# EAGLE design XBee_RPi_breakout (EAGLE 8.6.0)
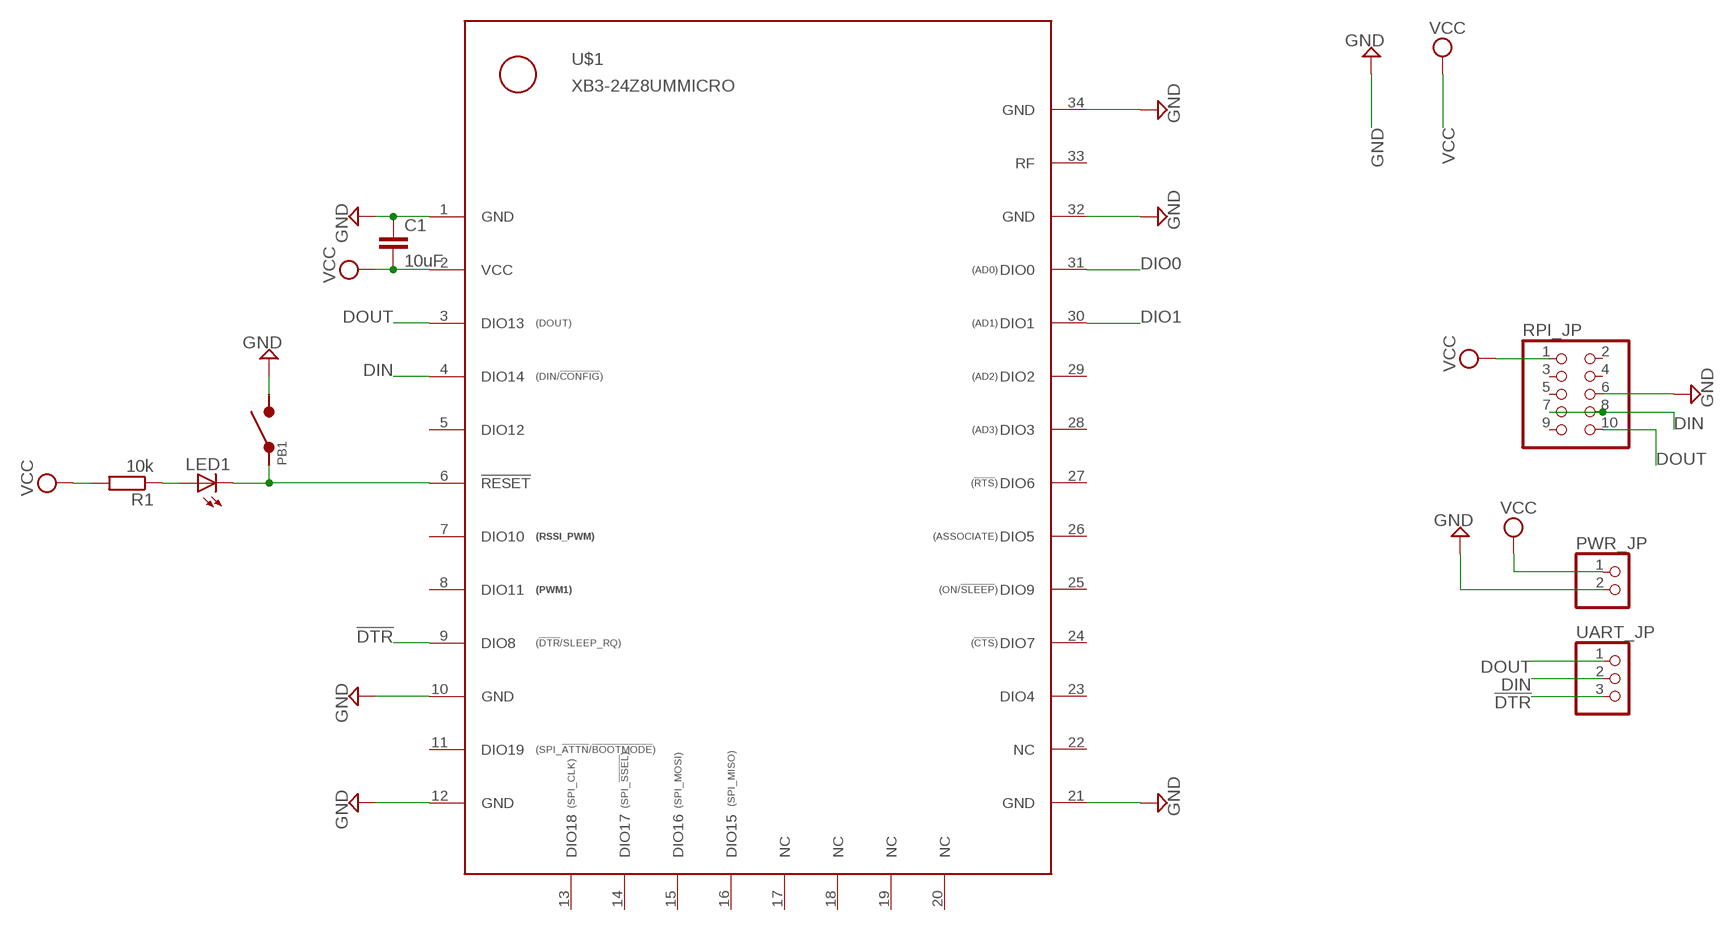
[diagram p0: schematic, sheet 1]

## Parts
C1  10uF  C-EUC0805  [C0805]
LED1  LEDSML0805  [SML0805]
PB1  PUSHBUTTON_2LEG  [PUSHBUTTON_6X3.5MM]
PWR_JP  PINHD-1X2  [1X02]
R1  10k  R-EU_M0805  [M0805]
RPI_JP  PINHD-2X5  [2X05]
U$1  XB3-24Z8UMMICRO  [XBEE3_MICRO]
UART_JP  PINHD-1X3  [1X03]

## Nets
!DTR: U$1.9(DIO8) UART_JP.3
!RST: LED1.C PB1.P$1 U$1.6(!RESET)
DIN: RPI_JP.7 RPI_JP.8 U$1.4(DIO14) UART_JP.2
DIO0: U$1.31(DIO0)
DIO1: U$1.30(DIO1)
DOUT: RPI_JP.10 U$1.3(DIO13) UART_JP.1
GND: C1.1 PB1.P$2 PWR_JP.2 RPI_JP.6 U$1.1(GND) U$1.10(GND) U$1.12(GND) U$1.21(GND) U$1.32(GND) U$1.34(GND)
N$1: LED1.A R1.1
VCC: C1.2 PWR_JP.1 R1.2 RPI_JP.1 U$1.2(VCC)
Unconnected: RPI_JP.2 RPI_JP.3 RPI_JP.4 RPI_JP.5 RPI_JP.9 U$1.5(DIO12) U$1.7(DIO10) U$1.8(DIO11) U$1.11(DIO19) U$1.13(DIO18) U$1.14(DIO17) U$1.15(DIO16) U$1.16(DIO15) U$1.17(NC) U$1.18(NC) U$1.19(NC) U$1.20(NC) U$1.22(NC) U$1.23(DIO4) U$1.24(DIO7) U$1.25(DIO9) U$1.26(DIO5) U$1.27(DIO6) U$1.28(DIO3) U$1.29(DIO2) U$1.33(RF)

## Library data of the parts
C1 = rcl:C-EU: CAPACITOR, European symbol; SPICEPREFIX: C
LED1 = led:LED: LED OSRAM: - CHIPLED LG R971, LG N971, LY N971, LG Q971, LY Q971, LO R971, LY R971 LH N974, LH R974 LS Q976, LO Q976, LY Q976 LO Q996 - Hyper CHIPLED LW Q18S LB Q993, LB Q99A, LB R99A - SideLED LS A670, LO A670, LY A670, LG A670, LP A670 LB A673, LV A673, LT A673, LW A673 LH A674 LY A675 LS A676, LA A676, LO A676, LY A676, LW A676 LS A679, LY A679, LG A679 - Hyper Micro SIDELED® LS Y876, LA Y876, LO Y876, LY Y876 LT Y87S - SmartLED LW L88C, LW L88S LB L89C, LB L89S, LG L890 LS L89K, LO L89K, LY L89K LS L896, LA L896, LO L896, LY L896 - TOPLED LS T670, LO T670, LY T670, LG T670, LP T670 LSG T670, LSP T670, LSY T670, LOP T670, LYG T670 LG T671, LOG T671, LSG T671 LB T673, LV T673, LT T673, LW T673 LH T674 LS T676, LA T676, LO T676, LY T676, LB T676, LH T676, LSB T676, LW T676 LB T67C, LV T67C, LT T67C, LS T67K, LO T67K, LY T67K, LW E67C LS E67B, LA E67B, LO E67B, LY E67B, LB E67C, LV E67C, LT E67C LW T67C LS T679, LY T679, LG T679 LS T770, LO T770, LY T770, LG T770, LP T770 LB T773, LV T773, LT T773, LW T773 LH T774 LS E675, LA E675, LY E675, LS T675 LS T776, LA T776, LO T776, LY T776, LB T776 LHGB T686 LT T68C, LB T68C - Hyper Mini TOPLED® LB M676 - Mini TOPLED Santana® LG M470 LS M47K, LO M47K, LY M47K Source: http://www.osram.convergy.de LUXEON: - LUMILED® LXK2-PW12-R00, LXK2-PW12-S00, LXK2-PW14-U00, LXK2-PW14-V00 LXK2-PM12-R00, LXK2-PM12-S00, LXK2-PM14-U00 LXK2-PE12-Q00, LXK2-PE12-R00, LXK2-PE12-S00, LXK2-PE14-T00, LXK2-PE14-U00 LXK2-PB12-K00, LXK2-PB12-L00, LXK2-PB12-M00, LXK2-PB14-N00, LXK2-PB14-P00, LXK2-PB14-Q00 LXK2-PR12-L00, LXK2-PR12-M00, LXK2-PR14-Q00, LXK2-PR14-R00 LXK2-PD12-Q00, LXK2-PD12-R00, LXK2-PD12-S00 LXK2-PH12-R00, LXK2-PH12-S00 LXK2-PL12-P00, LXK2-PL12-Q00, LXK2-PL12-R00 Source: www.luxeon.com KINGBRIGHT: KA-3528ASYC Source: www.kingbright.com
PB1 = CustomLib:PUSHBUTTON_2LEG
PWR_JP = pinhead:PINHD-1X2: PIN HEADER
R1 = rcl:R-EU_: RESISTOR, European symbol; SPICEPREFIX: R
RPI_JP = pinhead:PINHD-2X5: PIN HEADER
U$1 = CustomLib:XB3-24Z8UM: XB3-24Z8UM Xbee 3 micro module by DIGI international. Based on mechanical drawings in Xbee3 RF Module Hardware Reference Manual (90001543) by Digi Intrnational. Untested. Made by Nikolai Nymo
UART_JP = pinhead:PINHD-1X3: PIN HEADER

## Board
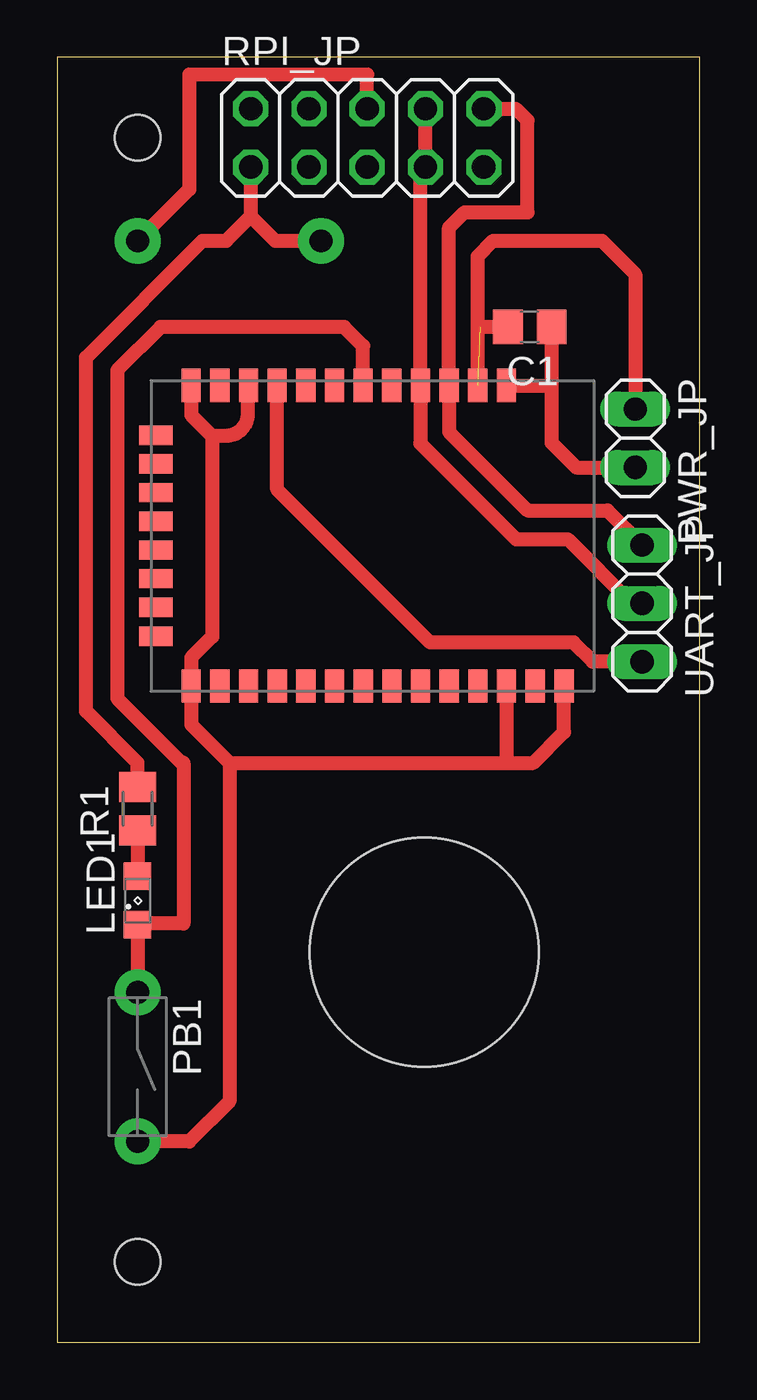
[diagram p1: board, top side]
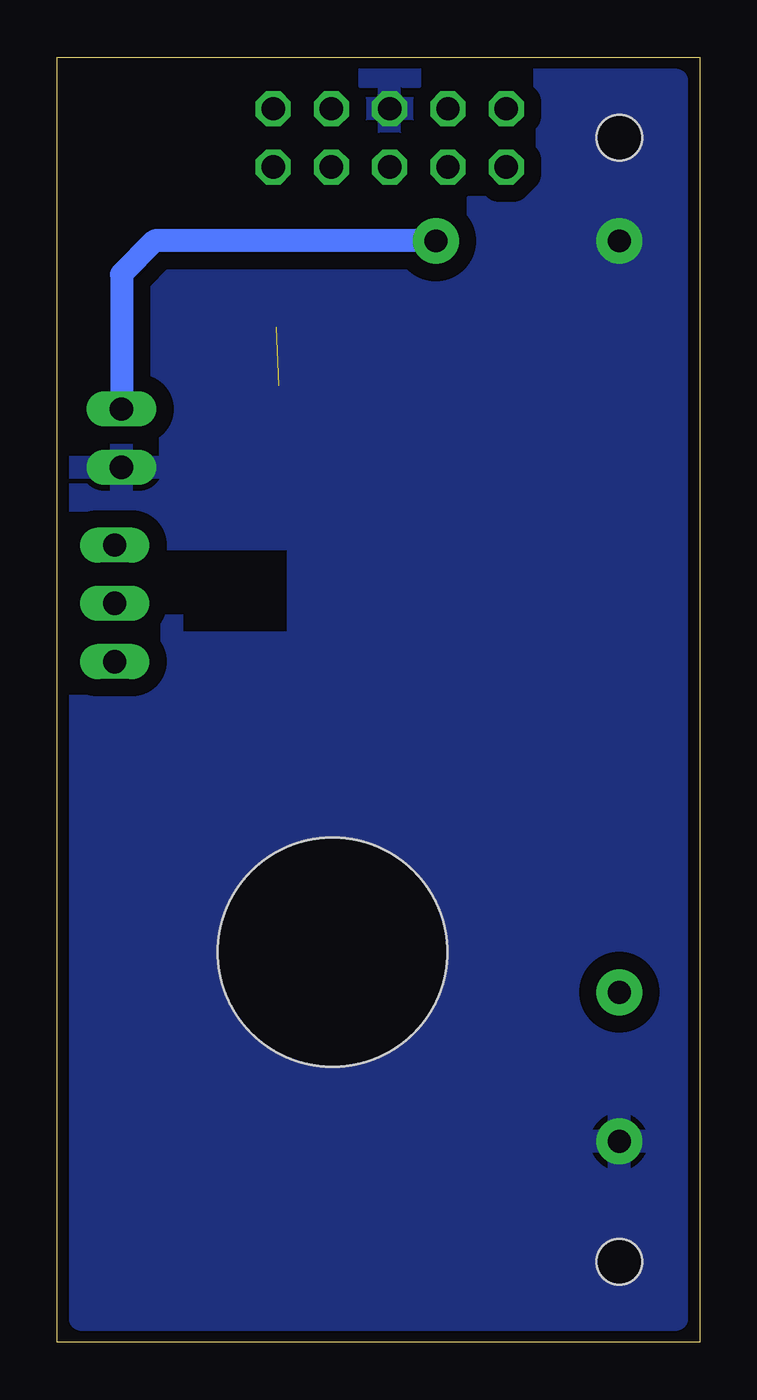
[diagram p2: board, bottom side, seen from below]

Size 28 x 56 mm. Coordinates in mm from the lower left corner, seen from the top.
Outline: 0,0 28,0 28,56 0,56 0,0
Copper layers (1*16): Top 0.035mm / dielectric 1.5mm / Bottom 0.035mm
Design rules "default *": minimum track width 6mil, minimum drill 0.35mm, track to track 0.75mm, track to pad 0.75mm, pad to pad 12mil, via to via 0.31mm, smd to smd 0.007875mm, copper to edge 0mil, drill to drill 0mil, minimum pad ring 10mil, minimum via ring 8mil, stop-mask expansion 4mil, vias tented up to drill 0mil, thermal gap 10mil
Holes 2 mm at 3.5,52.5 3.5,3.5
Holes 10 mm at 16,17

### Footprints (pad centres in the part's own frame; a part is rotated, then mirrored left to right if it is on the bottom)
C0805 = smd 1.3 x 1.5: 1 -0.95,0; 2 0.95,0
SML0805 = smd 1.2 x 1.2: A 1.05,0; C -1.05,0
PUSHBUTTON_6X3.5MM = drill 1 pad 2: P$1 1.25,-0.25; P$2 1.25,6.25
1X02 = drill 1.016 long: 1 -1.27,0; 2 1.27,0
M0805 = smd 1.3 x 1.6: 1 -0.95,0; 2 0.95,0
2X05 = drill 1.016 octagon: 1 -5.08,-1.27; 2 -5.08,1.27; 3 -2.54,-1.27; 4 -2.54,1.27; 5 0,-1.27; 6 0,1.27; 7 2.54,-1.27; 8 2.54,1.27; 9 5.08,-1.27; 10 5.08,1.27
XBEE3_MICRO = smd 1.448 x 0.838: 1 0.216,15.494; 2 0.216,14.244; 3 0.216,12.995; 4 0.216,11.745; 5 0.216,10.495; 6 0.216,9.246; 7 0.216,7.996; 8 0.216,6.746; 9 0.216,5.497; 10 0.216,4.247; 11 0.216,2.997; 12 0.216,1.753; 21 13.322,1.753; 22 13.322,3.002; 23 13.322,4.252; 24 13.322,5.502; 25 13.322,6.751; 26 13.322,8.001; 27 13.322,9.251; 28 13.322,10.5; 29 13.322,11.75; 30 13.322,13; 31 13.322,14.249; 32 13.322,15.499; 33 13.322,16.749; 34 13.322,18.009 | smd 0.838 x 1.448: 13 2.388,0.216; 14 3.637,0.216; 15 4.887,0.216; 16 6.137,0.216; 17 7.386,0.216; 18 8.636,0.216; 19 9.886,0.216; 20 11.151,0.216
1X03 = drill 1.016 long: 1 -2.54,0; 2 0,0; 3 2.54,0

### Placement (x,y rotation side)
C1  20.6,44.25 180 top
LED1  3.5,19.25 90 top
PB1  4.75,15 180 top
PWR_JP  25.2,39.4 270 top
R1  3.5,23.25 90 top
RPI_JP  13.51,52.49 0 top
U$1  4.09,41.92 270 top
UART_JP  25.5,32.2 270 top

### Tracks (layer width: path | path; a pad name or v marks a point on that pad's centre or on a via)
!DTR
  Top 0.61: UART_JP.3 23.34,29.66 22.5,30.5 16.25,30.5 9.58,37.17 U$1.9
!RST
  Top 0.61: U$1.6 13.33,43.42 12.5,44.25 4.5,44.25 2.61,42.36 2.61,28.06 5.42,25.25 5.5,25.25 5.5,18.25 3.55,18.25 arc90 LED1.C PB1.P$1
DIN
  Top 0.61: RPI_JP.8 RPI_JP.7 15.83,51 U$1.4 15.83,39.17 20,35 22.25,35 25.05,32.2 UART_JP.2
DOUT
  Top 0.61: RPI_JP.10 19.99,53.76 20.5,53.25 20.5,49.25 17.75,49.25 17.08,48.58 U$1.3 17.08,39.67 20.5,36.25 23.99,36.25 UART_JP.1
GND  (via drill 1 pad 2)
  Top 0.61: U$1.12 5.84,40.41 6.75,39.5 | 6.75,39.5 6.75,30.75 5.84,29.84 U$1.21 5.84,26.91 7.5,25.25 | RPI_JP.6 13.51,55.25 5.75,55.25 5.75,50.25 v3.5,48 | 7.5,25.25 7.5,10.5 5.75,8.75 PB1.P$2 | 7.5,25.25 19.5,25.25 | 19.5,25.25 20.75,25.25 22.09,26.59 U$1.34 | U$1.32 19.59,25.34 19.5,25.25 | C1.1 21.55,41.75 | 21.55,41.75 21.55,39.2 22.62,38.13 PWR_JP.2 | U$1.1 21.5,41.7 21.55,41.75 | U$1.10 arc90 8.3,41.67 8.3,40.45 arc-90 7.35,39.5 6.75,39.5
  pour Bottom: 1,55 27,55 27,1 1,1
N$1
  Top 0.61: R1.1 LED1.A
N$2
  cutout Bottom (isolate 2): 18,34.5 18,31 22.5,31 22.5,34.5
VCC  (via drill 1 pad 2)  (1 unrouted)
  Top 0.61: RPI_JP.1 8.43,49.07 | 8.43,49.07 9.5,48 v11.5,48 | 8.43,49.07 7.36,48 6.33,48 1.25,42.92 1.25,27.5 3.5,25.25 R1.2 | U$1.2 18.33,47.33 19,48 23.75,48 25.2,46.55 PWR_JP.1 | C1.2 18.44,44.25
  Bottom 1: v11.5,48 23.75,48 25.2,46.55 PWR_JP.1